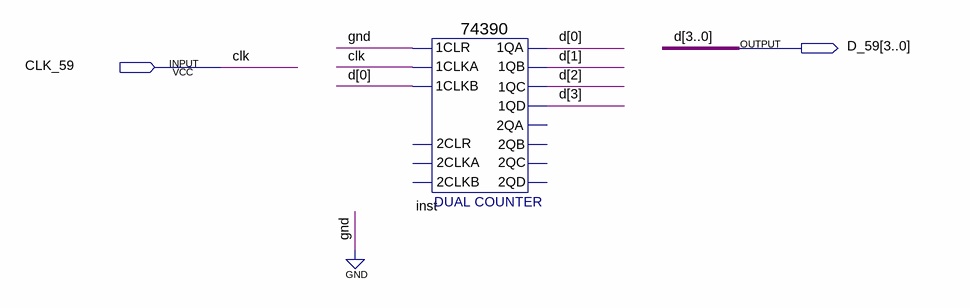
[diagram p0: schematic sheet]
// Quartus schematic cnt_m10.bdf as structural Verilog: 1 symbols, 2 pins
module cnt_m10 (
  input  CLK_59,
  output [3:0] D_59
);

  \74390  inst (
    .\1CLR (1'b0), .\1CLKA (CLK_59), .\1CLKB (D_59[0]), .\1QA (D_59[0]), .\1QB (D_59[1]), .\1QC (D_59[2]),
    .\1QD (D_59[3]));  // open: 2CLKA, 2CLR, 2CLKB, 2QA, 2QB, 2QC, 2QD

  // Other names for the same wires on the sheet: clk = CLK_59; d[3:0] = D_59
endmodule
